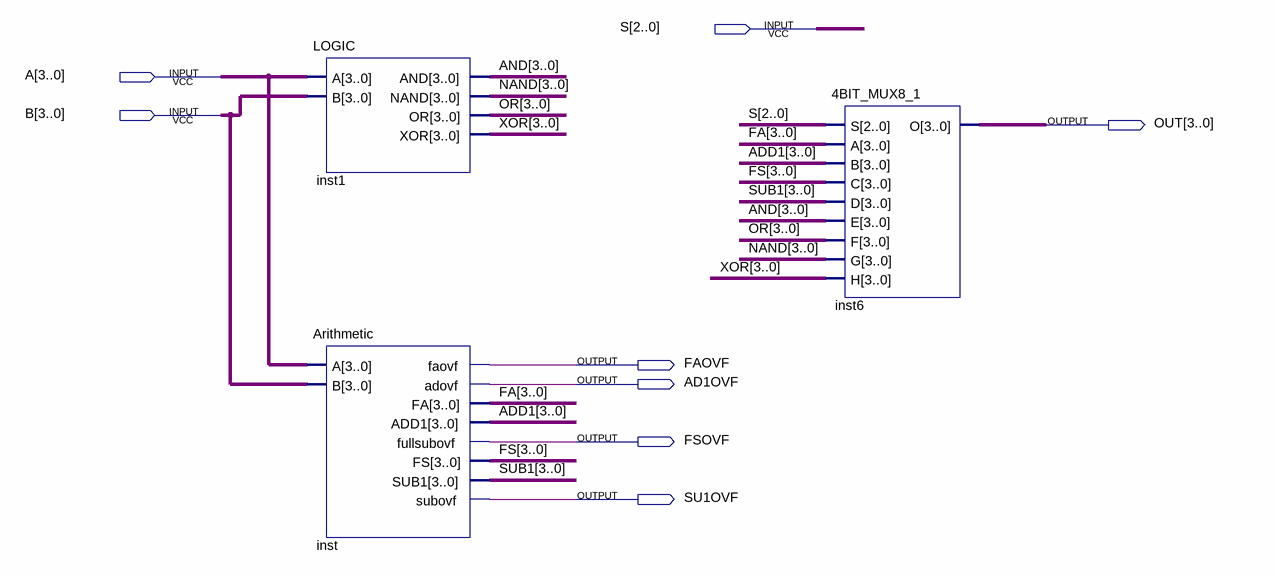
[diagram p0: schematic sheet]
// Quartus schematic ALU.bdf as structural Verilog: 3 symbols, 8 pins
module ALU (
  input  [2:0] S,
  input  [3:0] A,
  input  [3:0] B,
  output [3:0] OUT,
  output FAOVF,
  output AD1OVF,
  output FSOVF,
  output SU1OVF
);

  wire [3:0] ADD1, AND, FA, FS, NAND, OR, SUB1, XOR;

  LOGIC inst1 (.A(A), .B(B), .AND(AND), .NAND(NAND), .OR(OR), .XOR(XOR));
  Arithmetic inst (
    .A(A), .B(B), .faovf(FAOVF), .adovf(AD1OVF), .FA(FA), .ADD1(ADD1), .fullsubovf(FSOVF), .FS(FS),
    .SUB1(SUB1), .subovf(SU1OVF));
  \4BIT_MUX8_1  inst6 (.S(S), .A(FA), .B(ADD1), .C(FS), .D(SUB1), .E(AND), .F(OR), .G(NAND), .H(XOR), .O(OUT));
endmodule
